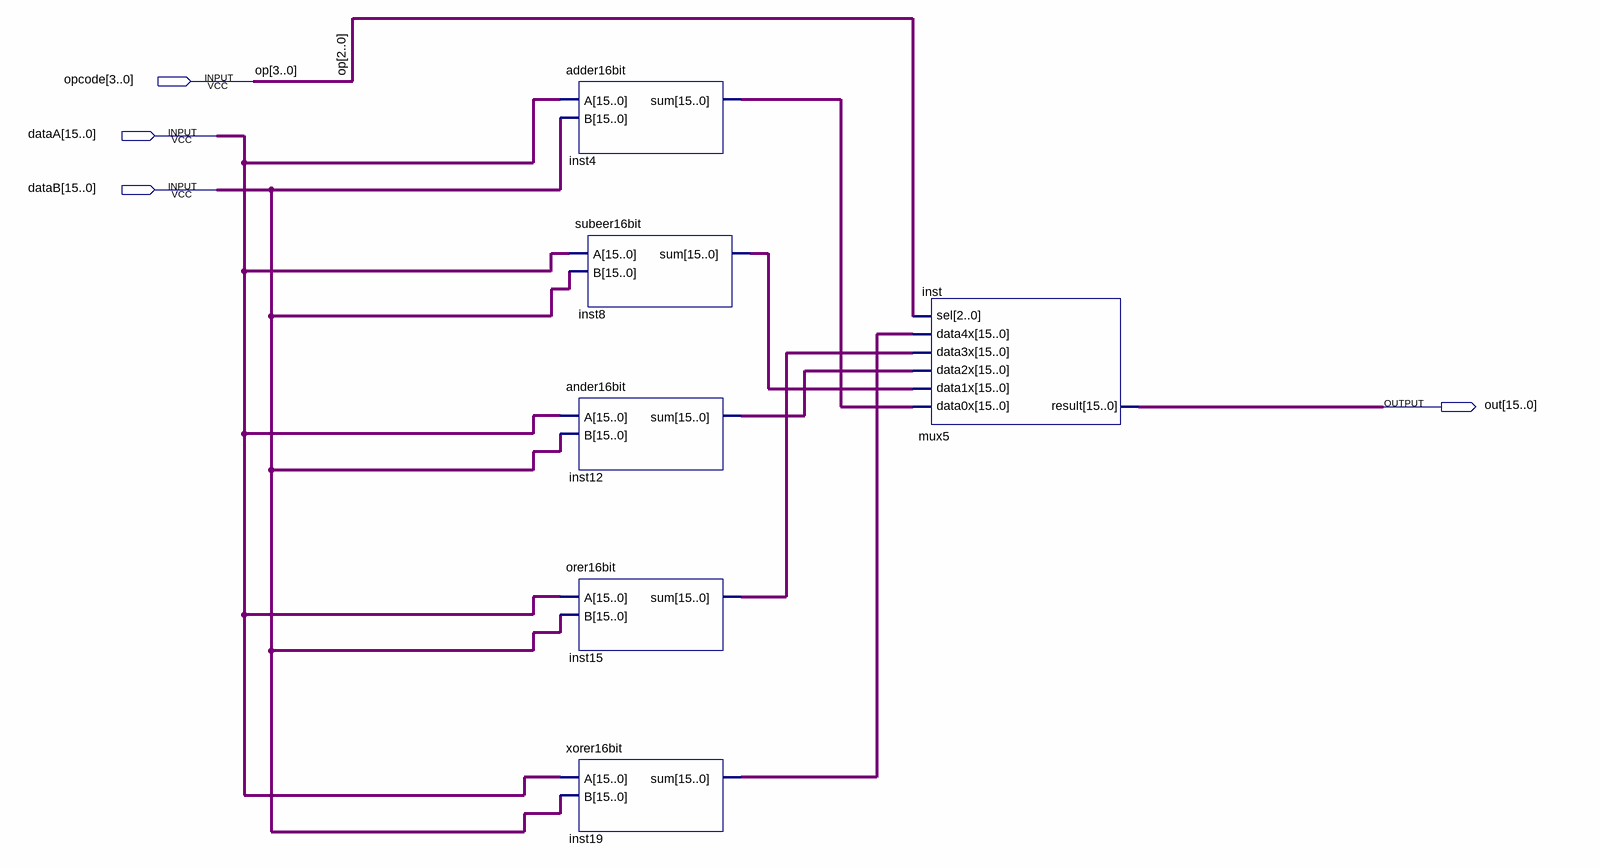
[diagram p0: schematic sheet]
// Quartus schematic alu.bdf as structural Verilog: 6 symbols, 4 pins
module alu (
  input  [3:0] opcode,
  input  [15:0] dataA,
  input  [15:0] dataB,
  output [15:0] out
);

  wire [15:0] inst4_sum, inst8_sum, inst12_sum, inst15_sum, inst19_sum;

  adder16bit inst4 (.A(dataA), .B(dataB), .sum(inst4_sum));
  subeer16bit inst8 (.A(dataA), .B(dataB), .sum(inst8_sum));
  ander16bit inst12 (.A(dataA), .B(dataB), .sum(inst12_sum));
  orer16bit inst15 (.A(dataA), .B(dataB), .sum(inst15_sum));
  xorer16bit inst19 (.A(dataA), .B(dataB), .sum(inst19_sum));
  mux5 inst (
    .data0x(inst4_sum), .data1x(inst8_sum), .data2x(inst12_sum), .data3x(inst15_sum), .data4x(inst19_sum),
    .sel(opcode[2:0]), .result(out));

  // Other names for the same wires on the sheet: op[3:0] = opcode
endmodule
